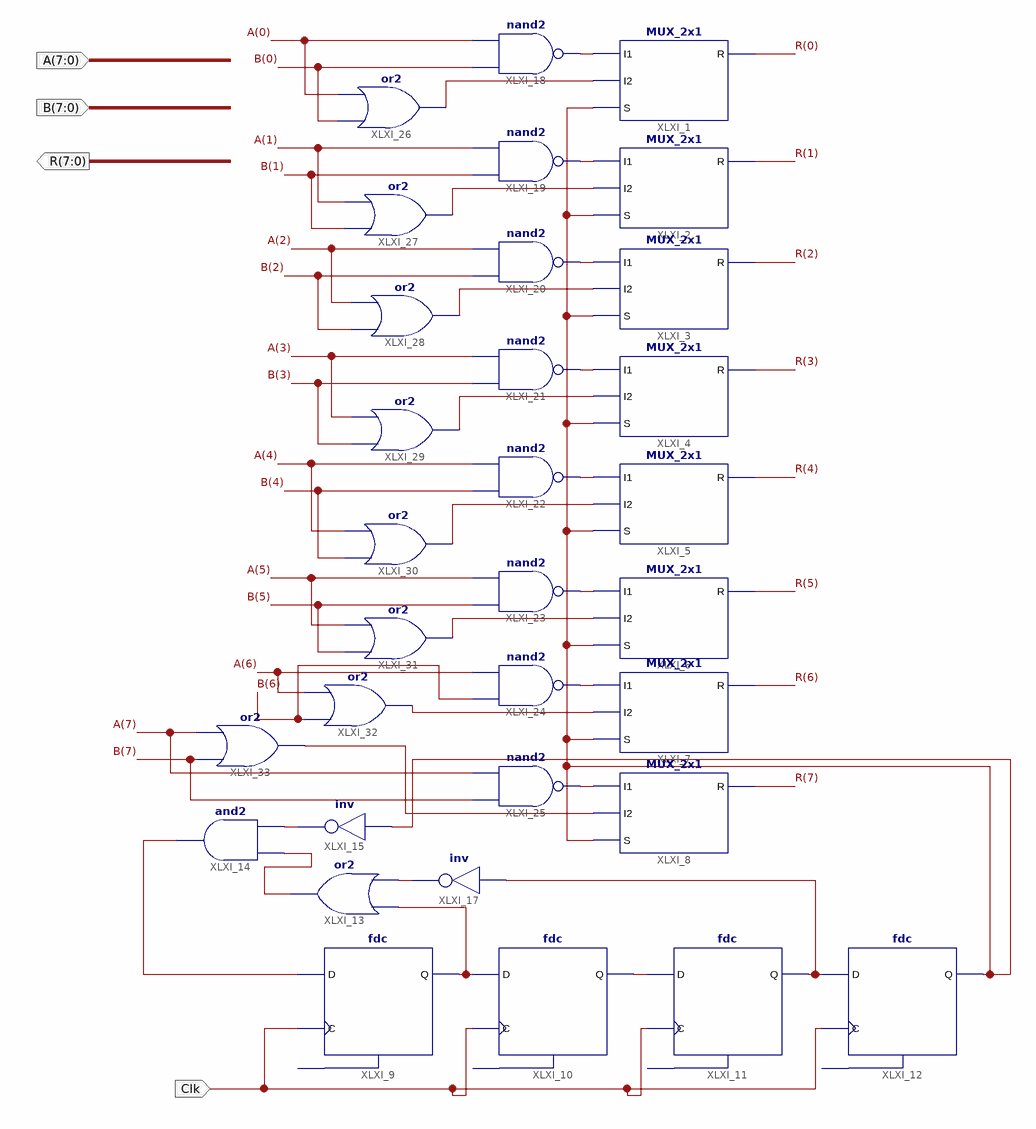
[diagram p0: schematic sheet 1]
// Xilinx ISE schematic first_c.sch (spartan3) as structural Verilog: 32 symbols, 4 ports
module first_c (
  input  Clk,
  input  [7:0] A,
  input  [7:0] B,
  output [7:0] R
);

  wire XLXN_1, XLXN_2, XLXN_3, XLXN_4, XLXN_5, XLXN_17, XLXN_21, XLXN_22, XLXN_23, XLXN_24, XLXN_25, XLXN_26,
       XLXN_27, XLXN_28, XLXN_29, XLXN_30, XLXN_31, XLXN_32, XLXN_33, XLXN_34, XLXN_35, XLXN_36, XLXN_37,
       XLXN_38;

  MUX_2x1 XLXI_1 (.I1(XLXN_23), .I2(XLXN_31), .S(XLXN_17), .R(R[0]));
  MUX_2x1 XLXI_2 (.I1(XLXN_24), .I2(XLXN_32), .S(XLXN_17), .R(R[1]));
  MUX_2x1 XLXI_3 (.I1(XLXN_25), .I2(XLXN_33), .S(XLXN_17), .R(R[2]));
  MUX_2x1 XLXI_4 (.I1(XLXN_26), .I2(XLXN_34), .S(XLXN_17), .R(R[3]));
  MUX_2x1 XLXI_5 (.I1(XLXN_27), .I2(XLXN_35), .S(XLXN_17), .R(R[4]));
  MUX_2x1 XLXI_6 (.I1(XLXN_28), .I2(XLXN_36), .S(XLXN_17), .R(R[5]));
  MUX_2x1 XLXI_7 (.I1(XLXN_29), .I2(XLXN_37), .S(XLXN_17), .R(R[6]));
  MUX_2x1 XLXI_8 (.I1(XLXN_30), .I2(XLXN_38), .S(XLXN_17), .R(R[7]));
  fdc XLXI_9 (.C(Clk), .D(XLXN_22), .Q(XLXN_1));  // open: CLR
  fdc XLXI_10 (.C(Clk), .D(XLXN_1), .Q(XLXN_2));  // open: CLR
  fdc XLXI_11 (.C(Clk), .D(XLXN_2), .Q(XLXN_3));  // open: CLR
  fdc XLXI_12 (.C(Clk), .D(XLXN_3), .Q(XLXN_17));  // open: CLR
  or XLXI_13 (XLXN_21, XLXN_5, XLXN_1);
  and XLXI_14 (XLXN_22, XLXN_4, XLXN_21);
  not XLXI_15 (XLXN_4, XLXN_17);
  not XLXI_17 (XLXN_5, XLXN_3);
  nand XLXI_18 (XLXN_23, B[0], A[0]);
  nand XLXI_19 (XLXN_24, B[1], A[1]);
  nand XLXI_20 (XLXN_25, B[2], A[2]);
  nand XLXI_21 (XLXN_26, B[3], A[3]);
  nand XLXI_22 (XLXN_27, B[4], A[4]);
  nand XLXI_23 (XLXN_28, B[5], A[5]);
  nand XLXI_24 (XLXN_29, B[6], A[6]);
  nand XLXI_25 (XLXN_30, B[7], A[7]);
  or XLXI_26 (XLXN_31, B[0], A[0]);
  or XLXI_27 (XLXN_32, B[1], A[1]);
  or XLXI_28 (XLXN_33, B[2], A[2]);
  or XLXI_29 (XLXN_34, B[3], A[3]);
  or XLXI_30 (XLXN_35, B[4], A[4]);
  or XLXI_31 (XLXN_36, B[5], A[5]);
  or XLXI_32 (XLXN_37, B[6], A[6]);
  or XLXI_33 (XLXN_38, B[7], A[7]);
endmodule
